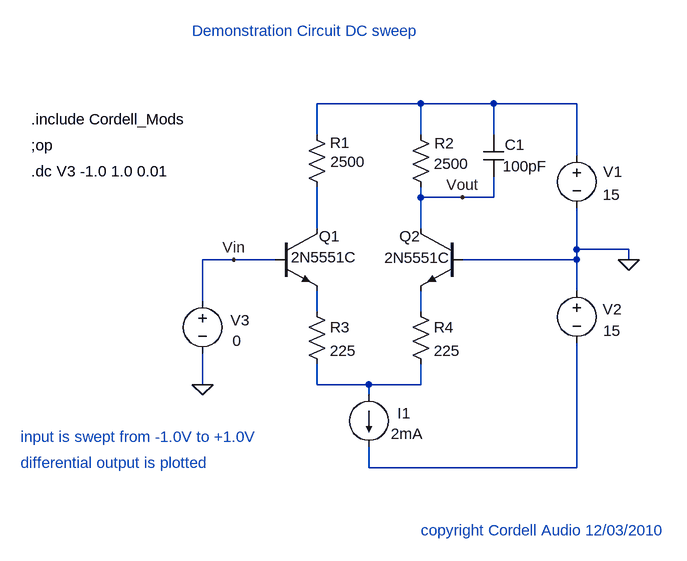
[diagram p0: schematic Demonstration circuit DC Sweep.asc]
Demonstration circuit DC Sweep.asc, the LTspice schematic file:
Version 4
SHEET 1 880 740
WIRE 160 64 0 64
WIRE 272 64 160 64
WIRE 400 64 272 64
WIRE 0 112 0 64
WIRE 160 112 160 64
WIRE 272 112 272 64
WIRE 400 144 400 64
WIRE 160 208 160 192
WIRE 224 208 160 208
WIRE 272 208 272 176
WIRE 272 208 224 208
WIRE 0 256 0 192
WIRE 160 256 160 208
WIRE 400 288 400 224
WIRE 480 288 400 288
WIRE -128 304 -176 304
WIRE -64 304 -128 304
WIRE 400 304 400 288
WIRE 400 304 224 304
WIRE 480 304 480 288
WIRE 400 352 400 304
WIRE -176 368 -176 304
WIRE 0 384 0 352
WIRE 160 384 160 352
WIRE -176 496 -176 448
WIRE 0 496 0 464
WIRE 80 496 0 496
WIRE 160 496 160 464
WIRE 160 496 80 496
WIRE 80 512 80 496
WIRE 80 624 80 592
WIRE 400 624 400 432
WIRE 400 624 80 624
FLAG 480 304 0
FLAG -176 496 0
FLAG -128 304 Vin
FLAG 224 208 Vout
SYMBOL res -16 96 R0
WINDOW 0 36 28 Left 2
WINDOW 3 37 57 Left 2
SYMATTR InstName R1
SYMATTR Value 2500
SYMBOL res 144 96 R0
WINDOW 0 37 29 Left 2
WINDOW 3 36 60 Left 2
SYMATTR InstName R2
SYMATTR Value 2500
SYMBOL voltage 400 128 R0
WINDOW 123 0 0 Left 2
WINDOW 39 0 0 Left 2
WINDOW 0 41 41 Left 2
WINDOW 3 40 76 Left 2
SYMATTR InstName V1
SYMATTR Value 15
SYMBOL voltage 400 336 R0
WINDOW 123 0 0 Left 2
WINDOW 39 0 0 Left 2
WINDOW 0 40 44 Left 2
WINDOW 3 41 77 Left 2
SYMATTR InstName V2
SYMATTR Value 15
SYMBOL npn -64 256 R0
WINDOW 3 24 44 Left 2
WINDOW 0 67 12 Left 2
SYMATTR Value 2N5551C
SYMATTR InstName Q1
SYMBOL npn 224 256 M0
WINDOW 3 18 45 Left 2
WINDOW 0 65 12 Left 2
SYMATTR Value 2N5551C
SYMATTR InstName Q2
SYMBOL res -16 368 R0
SYMATTR InstName R3
SYMATTR Value 225
SYMBOL res 144 368 R0
SYMATTR InstName R4
SYMATTR Value 225
SYMBOL current 80 512 R0
WINDOW 123 0 0 Left 2
WINDOW 39 0 0 Left 2
WINDOW 0 44 28 Left 2
WINDOW 3 34 60 Left 2
SYMATTR InstName I1
SYMATTR Value 2mA
SYMBOL cap 256 112 R0
WINDOW 3 30 48 Left 2
WINDOW 0 33 15 Left 2
SYMATTR Value 100pF
SYMATTR InstName C1
SYMBOL voltage -176 352 R0
WINDOW 123 0 0 Left 2
WINDOW 39 0 0 Left 2
WINDOW 0 43 45 Left 2
WINDOW 3 46 77 Left 2
SYMATTR InstName V3
SYMATTR Value 0
TEXT -440 128 Left 2 !;op
TEXT -192 -48 Left 2 ;Demonstration Circuit DC sweep
TEXT -440 168 Left 2 !.dc V3 -1.0 1.0 0.01
TEXT -456 576 Left 2 ;input is swept from -1.0V to +1.0V
TEXT -456 616 Left 2 ;differential output is plotted
TEXT -440 88 Left 2 !.include Cordell_Mods
TEXT 160 720 Left 2 ;copyright Cordell Audio 12/03/2010

The netlist it stands for:
* Demonstration circuit DC Sweep.asc
R1 N001 N002 2500
R2 N001 Vout 2500
V1 N001 0 15
V2 0 N006 15
Q1 N002 Vin N003 0 2N5551C
Q2 Vout 0 N004 0 2N5551C
R3 N003 N005 225
R4 N004 N005 225
I1 N005 N006 2mA
C1 N001 Vout 100pF
V3 Vin 0 0
.model NPN NPN
.model PNP PNP
.lib standard.bjt
;op
* Demonstration Circuit DC sweep
.dc V3 -1.0 1.0 0.01
* input is swept from -1.0V to +1.0V
* differential output is plotted
.include Cordell_Mods
* copyright Cordell Audio 12/03/2010
.backanno
.end